# EasyEDA schematic 04.json
TITLE: rapoukBoardv4; REV: 1.0; Date: 02-09-24; Sheet: 1/1; Drawn By: Roman Suk; Company: Suk Industries
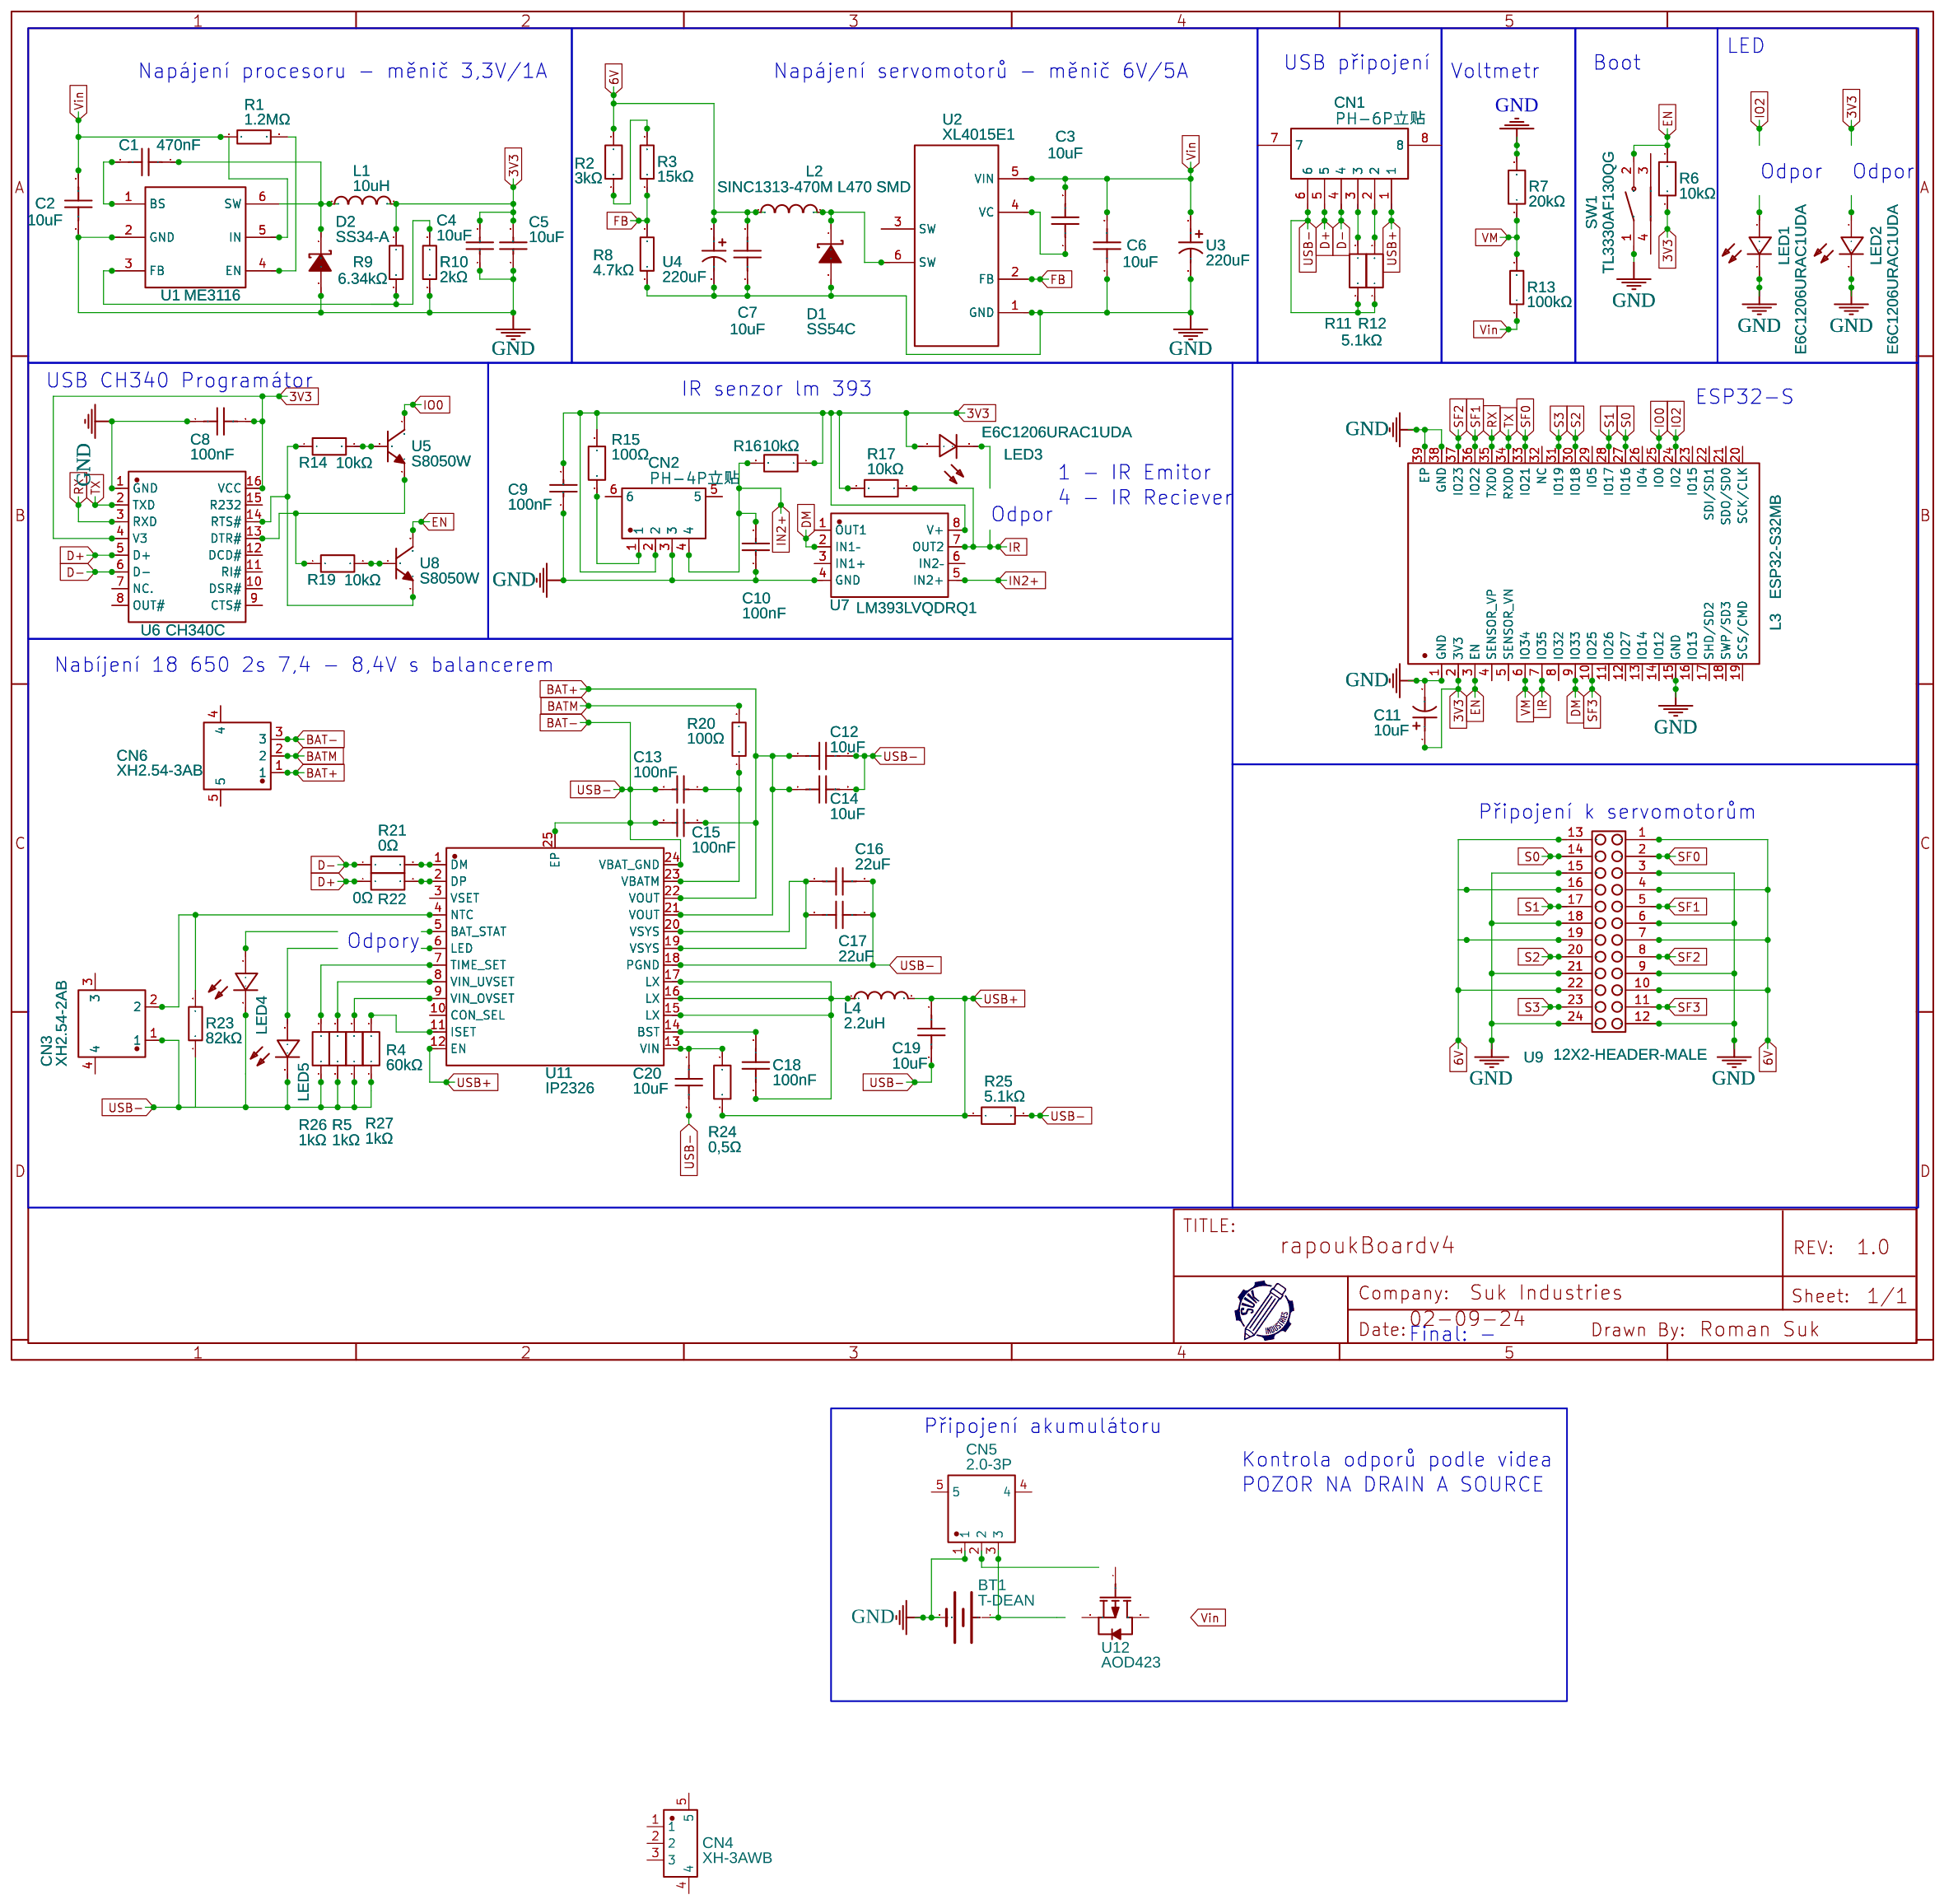
[diagram p0: schematic sheet]

## Parts
BT1  T-DEAN  [T_DEAN]
C1  470nF  [C1206]
C2  10uF  [C1206]
C3  10uF  [C1206]
C4  10uF  [C1206]
C5  10uF  [C1206]
C6  10uF  [C1206]
C7  10uF  [C1206]
C8  100nF  [C1206]
C9  100nF  [C1206]
C10  100nF  [C1206]
C11  10uF  [CAP-SMD_BD4.0-L4.3-W4.3-FD]
C12  10uF  [C1206]
C13  100nF  [C1206]
C14  10uF  [C1206]
C15  100nF  [C1206]
C16  22uF  [C1206]
C17  22uF  [C1206]
C18  100nF  [C1206]
C19  10uF  [C1206]
C20  10uF  [C1206]
CN1  PH-6P立贴  [CONN-SMD_6P-P2.0-L14.0-W5.4]
CN2  PH-4P立贴  [CONN-SMD_PH2.0-4P]
CN3  XH2.54-2AB  [CONN-SMD_2P-P2.54_XH2.54-2AB]
CN4  XH-3AWB  [CONN-SMD_XH-3AWB]
CN5  2.0-3P  [CONN-SMD_3P-LT]
CN6  XH2.54-3AB  [CONN-SMD_3P-P2.54_XH2.54-3AB]
D1  SS54C  [SMC_L7.5-W5.8-LS8.3-RD]
D2  SS34-A  [SMA_L4.3-W2.6-LS5.2-RD]
L1  10uH  [IND-SMD_L5.8-W5.2_CD54]
L2  SINC1313-470M L470 SMD  [SINC1313]
L3  ESP32-S32MB  [WIFIM-SMD_ESP32-S32MB]
L4  2.2uH  [IND-SMD_L5.8-W5.2]
LED1  E6C1206URAC1UDA  [LED1206-R-RD_RED]
LED2  E6C1206URAC1UDA  [LED1206-R-RD_RED]
LED3  E6C1206URAC1UDA  [LED1206-R-RD_RED]
LED4  E6C1206URAC1UDA  [LED1206-R-RD_RED]
LED5  E6C1206URAC1UDA  [LED1206-R-RD_RED]
R1  1.2MΩ  [R0603]
R2  3kΩ  [R1206]
R3  15kΩ  [R1206]
R4  60kΩ  [R1206]
R5  1kΩ  [R1206]
R6  10kΩ  [R1206]
R7  20kΩ  [R1206]
R8  4.7kΩ  [R1206]
R9  6.34kΩ  [R1206]
R10  2kΩ  [R1206]
R11  5.1kΩ  [R0603]
R12  5.1kΩ  [R0603]
R13  100kΩ  [R1206]
R14  10kΩ  [R1206]
R15  100Ω  [R1206]
R16  10kΩ  [R1206]
R17  10kΩ  [R1206]
R19  10kΩ  [R1206]
R20  100Ω  [R1206]
R21  0Ω  [R1206]
R22  0Ω  [R1206]
R23  82kΩ  [R1206]
R24  0,5Ω  [R1206]
R25  5.1kΩ  [R0603]
R26  1kΩ  [R1206]
R27  1kΩ  [R1206]
SW1  TL3330AF130QG  [SW-SMD_E-SWITCH_TL3330]
U1  ME3116  [SOT-23-6_L2.9-W1.6-P0.95-LS2.8-BL]
U2  XL4015E1  [TO-263-5_L10.2-W8.9-P1.70-TL]
U3  220uF  [CAP-SMD_BD6.3-L6.6-W6.6-FD]
U4  220uF  [CAP-SMD_BD6.3-L6.6-W6.6-FD]
U5  S8050W  [SOT-323-3_L2.1-W1.3-P1.30-LS2.3-BR]
U6  CH340C  [SOP-16_L10.0-W3.9-P1.27-LS6.0-BL]
U7  LM393LVQDRQ1  [SOIC-8_L4.9-W3.9-P1.27-LS6.0-BL]
U8  S8050W  [SOT-323-3_L2.1-W1.3-P1.30-LS2.3-BR]
U9  12X2-HEADER-MALE  [12X2-HEADER-MALE]
U11  IP2326  [VQFN-24_L4.0-W4.0-P0.50-BL-EP2.5]
U12  AOD423  [TO-252-2_L6.6-W6.1-P4.60-LS10.0-BR-CW]

## Library data of the parts
BT1 = T-DEAN: Contributor: michalklis
C1 = TCC1206X7R474K500FT: Contributor: LCSC; Supplier: LCSC; Supplier Part: C282872; Manufacturer: CCTC(三环); JLCPCB Part Class: Extended Part
C2 C3 C6 C7 C12 C14 C19 C20 = TCC1206X7R106K250HT: Contributor: LCSC; Supplier: LCSC; Supplier Part: C380364; Manufacturer: CCTC(三环); JLCPCB Part Class: Extended Part
C4 C5 = TMK316B7106KL-TD: Supplier: LCSC; Manufacturer: TAIYO YUDEN(太诱); Supplier Part: C92831; JLCPCB Part Class: Extended Part
C8 = 1206Y1000104KXR: Contributor: LCSC; Supplier: LCSC; Supplier Part: C2319128; Manufacturer: Knowles(楼氏); JLCPCB Part Class: Extended Part
C9 C10 C13 C15 = C1206X104K451T: Supplier: LCSC; Manufacturer: IHHEC(禾伸堂); Supplier Part: C106025; JLCPCB Part Class: Extended Part
C11 = RST10UF16V013: Supplier: LCSC; Supplier Part: C4747968; Manufacturer: KNSCHA(科尼盛); JLCPCB Part Class: Extended Part; Contributor: lcsc
C16 C17 = CL31X226KQHNNNE: Contributor: LCSC; Supplier: LCSC; Supplier Part: C444887; Manufacturer: SAMSUNG(三星); JLCPCB Part Class: Extended Part
C18 = C1206X104J1RECAUTO7210: Contributor: lcsc; Supplier: LCSC; Supplier Part: C2253379; Manufacturer: KEMET(基美); JLCPCB Part Class: Extended Part
CN1 = PH-6P立贴: Contributor: LCSC; Supplier: LCSC; Supplier Part: C64659; Manufacturer: BOOMELE(博穆精密); JLCPCB Part Class: Extended Part
CN2 = PH-4P立贴: Contributor: LCSC; Supplier: LCSC; Supplier Part: C67258; Manufacturer: BOOMELE(博穆精密); JLCPCB Part Class: Extended Part
CN3 = XH2.54-2AB: Contributor: LCSC; Supplier: LCSC; Supplier Part: C146125; Manufacturer: BOOMELE(博穆精密); Manufacturer Part: XH-2P立贴; JLCPCB Part Class: Extended Part
CN4 = XH-3AWB: Contributor: LCSC; Supplier: LCSC; Supplier Part: C141812; Manufacturer: BOOMELE(博穆精密); Manufacturer Part: XH-3P卧贴; JLCPCB Part Class: Extended Part
CN5 = 2.0-3P: Contributor: LCSC; Supplier: LCSC; Supplier Part: C146054; Manufacturer: BOOMELE(博穆精密); Manufacturer Part: PH-3P立贴; JLCPCB Part Class: Extended Part
CN6 = XH2.54-3AB: Contributor: LCSC; Supplier: LCSC; Supplier Part: C146126; Manufacturer: BOOMELE(博穆精密); Manufacturer Part: XH-3P立贴; JLCPCB Part Class: Extended Part
D1 = SS54C: Contributor: LCSC; Supplier: LCSC; Supplier Part: C330398; Manufacturer: LGE(鲁光); Manufacturer Part: SS54; JLCPCB Part Class: Extended Part
D2 = SS34-A: Contributor: LCSC; Supplier: LCSC; Supplier Part: C143201; Manufacturer: FMS(美丽微); JLCPCB Part Class: Extended Part
L1 = CD54YP0504-100M: Contributor: lcsc; Supplier: LCSC; Supplier Part: C492291; Manufacturer: YJYCOIN(益嘉源); JLCPCB Part Class: Extended Part
L2 = SINC1313-470M L470 SMD: link: https://vi.aliexpress.com/item/1005006932666277.html?spm=a2g0o.productlist.main.1.240cENmjENmj9N&algo_pvid=bf29db7b-fa88-44d8-ba6d-a49f370a463e&algo_exp_id=bf29db7b-fa88-44d8-ba6d-a49f370a463e-0&pdp_npi=4%40dis%21USD%215.23%214.60%21%21%2137.50%2133.00%21%40210313e917158827587508967e9ebd%2112000038772414878%21sea%21CZ%210%21AB&curPageLogUid=HUxgkZ86eIhu&utparam-url=scene%3Asearch%7Cquery_from%3A; Contributor: romansuk05; Package Display: No
L3 = ESP32-S32MB: Contributor: LCSC; Supplier: LCSC; Supplier Part: C2764096; Manufacturer: Ai-Thinker(安信可); Manufacturer Part: ESP32-S32Mb; JLCPCB Part Class: Extended Part
L4 = CD54-2R2M-T: Contributor: LCSC; Supplier: LCSC; Supplier Part: C501730; Manufacturer: Me-TECH(美台高科); JLCPCB Part Class: Extended Part
LED1-LED5 = E6C1206URAC1UDA: Contributor: LCSC; Supplier: LCSC; Supplier Part: C375458; Manufacturer: ekinglux(亿晶源); JLCPCB Part Class: Extended Part
R1 = RMC06031.2M1%N: Contributor: LCSC; Supplier: LCSC; Supplier Part: C325657; Manufacturer: Tyohm(幸亚电阻); JLCPCB Part Class: Extended Part
R2 = CR1206J3K00P05Z: Contributor: LCSC; Supplier: LCSC; Supplier Part: C881253; Manufacturer: EVER OHMS(天二科技); JLCPCB Part Class: Extended Part
R3 = RT1206FRD0715KL: Contributor: LCSC; Supplier: LCSC; Manufacturer: YAGEO(国巨); Supplier Part: C136874; JLCPCB Part Class: Extended Part
R4 = MCA12060D6002BP500: Contributor: lcsc; Supplier: LCSC; Supplier Part: C1711754; Manufacturer: VISHAY(威世); JLCPCB Part Class: Extended Part
R5 R26 R27 = SCR1206J1K: Contributor: lcsc; Supplier: LCSC; Supplier Part: C3018015; Manufacturer: VO(翔胜); JLCPCB Part Class: Extended Part
R6 R14 R16 R17 R19 R24 = SCR1206F10K: Supplier: LCSC; Supplier Part: C3017025; Manufacturer: VO(翔胜); JLCPCB Part Class: Extended Part; Contributor: lcsc
R7 = CR1206F20KP05: Contributor: LCSC; Supplier: LCSC; Supplier Part: C429423; Manufacturer: EVER OHMS(天二科技); JLCPCB Part Class: Extended Part
R8 = CRCW12064K70FKEA: Contributor: LCSC; Supplier: LCSC; Supplier Part: C242482; Manufacturer: VISHAY(威世); JLCPCB Part Class: Extended Part
R9 = RS-06K6341FT: Contributor: LCSC; Supplier: LCSC; Supplier Part: C323116; Manufacturer: FH(风华); JLCPCB Part Class: Extended Part
R10 = RTT06202JTP: Supplier: LCSC; Manufacturer: RALEC(旺诠); Supplier Part: C104689; JLCPCB Part Class: Extended Part
R11 R12 R25 = HOARG0603-1/10W-5.1KR-0.1%-TCR25: Supplier: LCSC; Supplier Part: C5123614; Manufacturer: Milliohm(毫欧); Manufacturer Part: HoARG0603-1/10W-5.1KR-0.1%-TCR25; JLCPCB Part Class: Extended Part; Contributor: lcsc
R13 = QR1206F100KP05: Contributor: LCSC; Supplier: LCSC; Supplier Part: C176233; Manufacturer: EVER OHMS(天二科技); Manufacturer Part: QR1206F100KP05Z; JLCPCB Part Class: Extended Part
R15 = SCR1206F100R: Contributor: lcsc; Supplier: LCSC; Supplier Part: C3017190; Manufacturer: VO(翔胜); JLCPCB Part Class: Extended Part
R20 = AECR1206F100RK9: Contributor: LCSC; Supplier: LCSC; Supplier Part: C328408; Manufacturer: RESI(开步睿思); JLCPCB Part Class: Extended Part
R21 R22 = CR1206J0R00P05Z: Contributor: LCSC; Supplier: LCSC; Supplier Part: C881108; Manufacturer: EVER OHMS(天二科技); JLCPCB Part Class: Extended Part
R23 = AECR1206F82K0K9: Contributor: LCSC; Supplier: LCSC; Supplier Part: C352030; Manufacturer: RESI(开步睿思); JLCPCB Part Class: Extended Part
SW1 = TL3330AF130QG: Contributor: LCSC; Supplier: LCSC; Supplier Part: C2886885; Manufacturer: E-Switch; JLCPCB Part Class: Extended Part
U1 = ME3116: Supplier: LCSC; Manufacturer: MICRONE(南京微盟); Manufacturer Part: ME3116AM6G; Supplier Part: C97643; JLCPCB Part Class: Extended Part
U2 = XL4015E1: Supplier: LCSC; Manufacturer: XLSEMI(芯龙); Supplier Part: C51661; JLCPCB Part Class: Extended Part
U3 U4 = CK220UF16V167RV0142: Supplier: LCSC; Supplier Part: C5246590; Manufacturer: KNSCHA(科尼盛); JLCPCB Part Class: Extended Part; Contributor: lcsc
U5 U8 = S8050W: Contributor: lcsc; Supplier: LCSC; Supplier Part: C5186011; Manufacturer: Slkor(萨科微)
U6 = CH340C: Supplier: LCSC; Manufacturer: WCH(南京沁恒); Supplier Part: C84681; JLCPCB Part Class: Extended Part
U7 = LM393LVQDRQ1: Contributor: lcsc; Supplier: LCSC; Supplier Part: C3039507; Manufacturer: TI(德州仪器); JLCPCB Part Class: Extended Part
U9 = 12X2-HEADER-MALE: Supplier Part: undefined; Contributor: Tobias Ottestad
U11 = IP2326: Contributor: LCSC; Supplier: LCSC; Supplier Part: C2832094; Manufacturer: INJOINIC(英集芯); JLCPCB Part Class: Extended Part
U12 = AOD423: Contributor: lcsc; Supplier: LCSC; Supplier Part: C3281246; Manufacturer: AOS; JLCPCB Part Class: Extended Part

## Nets
3V3: C4.2 C5.2 C8.2 C9.2 C11.1 CN2.2 L1.2 L3.2(3V3) LED3.1(+) R6.2 R9.1 R15.1 R16.1 R17.1 U6.4(V3) U6.16(VCC) U7.8(V+)
6V: C7.2 L2.1 R2.2 U4.1 U9.1 U9.4 U9.7 U9.10 U9.13 U9.16 U9.19 U9.22
GND: BT1.2 C2.1 C4.1 C5.1 C6.1 C7.1 C8.1 C9.1 C10.1 C11.2 CN2.3 CN5.1 D1.2(A) D2.2(A) L3.1(GND) L3.15(GND) L3.38(GND) L3.39(EP) LED1.2(-) LED2.2(-) R7.2 R8.1 R10.1 SW1.1 U1.2(GND) U2.1(GND) U3.2 U4.2 U6.1(GND) U7.4(GND) U9.3 U9.6 U9.9 U9.12 U9.15 U9.18 U9.21 U9.24
Vin: C2.2 C3.2 C6.2 R1.1 R13.1 U1.5(IN) U2.5(VIN) U3.1
BAT+: C12.1 C14.1 C15.1 CN6.1 U11.21(VOUT) U11.22(VOUT)
BAT-: C12.2 C13.2 C14.2 C15.2 C16.2 C17.2 C19.2 C20.2 CN1.6 CN3.1 CN6.3 LED4.2(-) LED5.2(-) R4.1 R5.1 R11.1 R12.1 R23.1 R25.2 R26.1 R27.1 U11.18(PGND) U11.24(VBAT_GND) U11.25(EP)
BATM: CN6.2 R20.2
D+: CN1.5 R22.1 U6.5(D+)
D-: CN1.4 R21.1 U6.6(D-)
DM: L3.9(IO33) U7.2(IN1–)
EN: L3.3(EN) R6.1 SW1.2 U8.3(C)
FB: R3.1 R8.2 U2.2(FB)
IN2+: C10.2 CN2.4 R16.2 U7.5(IN2+)
IO0: L3.25(IO0) U5.3(C)
IO2: L3.24(IO2)
IR: L3.7(IO35) R17.2 U7.7(OUT2)
RX: L3.35(TXD0) U6.3(RXD)
S0: L3.27(IO16) U9.14
S1: L3.28(IO17) U9.17
S2: L3.30(IO18) U9.20
S3: L3.31(IO19) U9.23
SF0: L3.33(IO21) U9.2
SF1: L3.36(IO22) U9.5
SF2: L3.37(IO23) U9.8
SF3: L3.10(IO25) U9.11
TX: L3.34(RXD0) U6.2(TXD)
USB+: C19.1 CN1.1 L4.2 R24.2 R25.1 U11.12(EN)
VM: L3.6(IO34) R7.1 R13.2
Net-(BT1-1): BT1.1 CN5.3
Net-(C1-1): C1.1 D2.1(C) L1.1 U1.6(SW)
Net-(C1-2): C1.2 U1.1(BS)
Net-(C3-1): C3.1 U2.4(VC)
Net-(C13-1): C13.1 R20.1 U11.23(VBATM)
Net-(C16-1): C16.1 C17.1 U11.19(VSYS) U11.20(VSYS)
Net-(C18-1): C18.1 L4.1 U11.15(LX) U11.16(LX) U11.17(LX)
Net-(C18-2): C18.2 U11.14(BST)
Net-(C20-1): C20.1 R24.1 U11.13(VIN)
Net-(CN1-2): CN1.2 R12.2
Net-(CN1-3): CN1.3 R11.2
Net-(CN2-1): CN2.1 R15.2
Net-(CN3-2): CN3.2 R23.2 U11.4(NTC)
Net-(D1-1): D1.1(K) L2.2 U2.6(SW)
Net-(R1-2): R1.2 U1.4(EN)
Net-(R2-1): R2.1 R3.2
Net-(R4-2): R4.2 U11.11(ISET)
Net-(R5-2): R5.2 U11.8(VIN_UVSET)
Net-(R9-2): R9.2 R10.2 U1.3(FB)
Net-(R14-1): R14.1 U6.14(RTS#) U8.2(E)
Net-(R14-2): R14.2 U5.1(B)
Net-(R19-1): R19.1 U5.2(E) U6.13(DTR#)
Net-(R19-2): R19.2 U8.1(B)
Net-(R21-2): R21.2 U11.1(DM)
Net-(R22-2): R22.2 U11.2(DP)
Net-(R26-2): R26.2 U11.7(TIME_SET)
Net-(R27-2): R27.2 U11.9(VIN_OVSET)

Not connected (* = marked no-connect by the designer): CN1 7 8; CN2 5 6; CN3 3 4; CN4 1 2 3 4 5; CN5 2 4 5; CN6 4 5; L3 4(SENSOR_VP) 5(SENSOR_VN) 8(IO32) 11(IO26) 12(IO27) 13(IO14) 14(IO12) 16(IO13) 17(SHD/SD2) 18(SWP/SD3) 19(SCS/CMD) 20(SCK/CLK) 21(SDO/SD0) 22(SDI/SD1) 23(IO15) 26(IO4) 29(IO5) 32(NC); LED1 1(+); LED2 1(+); LED3 2(-); LED4 1(+); LED5 1(+); SW1 3 4; U2 3(SW); U6 7(NC.) 8(OUT#) 9(CTS#) 10(DSR#) 11(RI#) 12(DCD#) 15(R232); U7 1(OUT1) 3(IN1+) 6(IN2–); U11 3(VSET) 5(BAT_STAT) 6(LED) 10(CON_SEL); U12 1(G) 2(D) 3(S)

## Notes on the sheet
- LED
- USB připojení
- Boot
- Napájení procesoru - měnič 3,3V/1A
- Napájení servomotorů - měnič 6V/5A
- Voltmetr
- Odpor
- Odpor
- USB CH340 Programátor
- IR senzor lm 393
- ESP32-S
- 1 - IR Emitor
- 4 - IR Reciever
- Odpor
- Nabíjení 18 650 2s 7,4 - 8,4V s balancerem
- Připojení k servomotorům
- Odpory
- Final: -
- Připojení akumulátoru
- Kontrola odporů podle videa
- POZOR NA DRAIN A SOURCE
